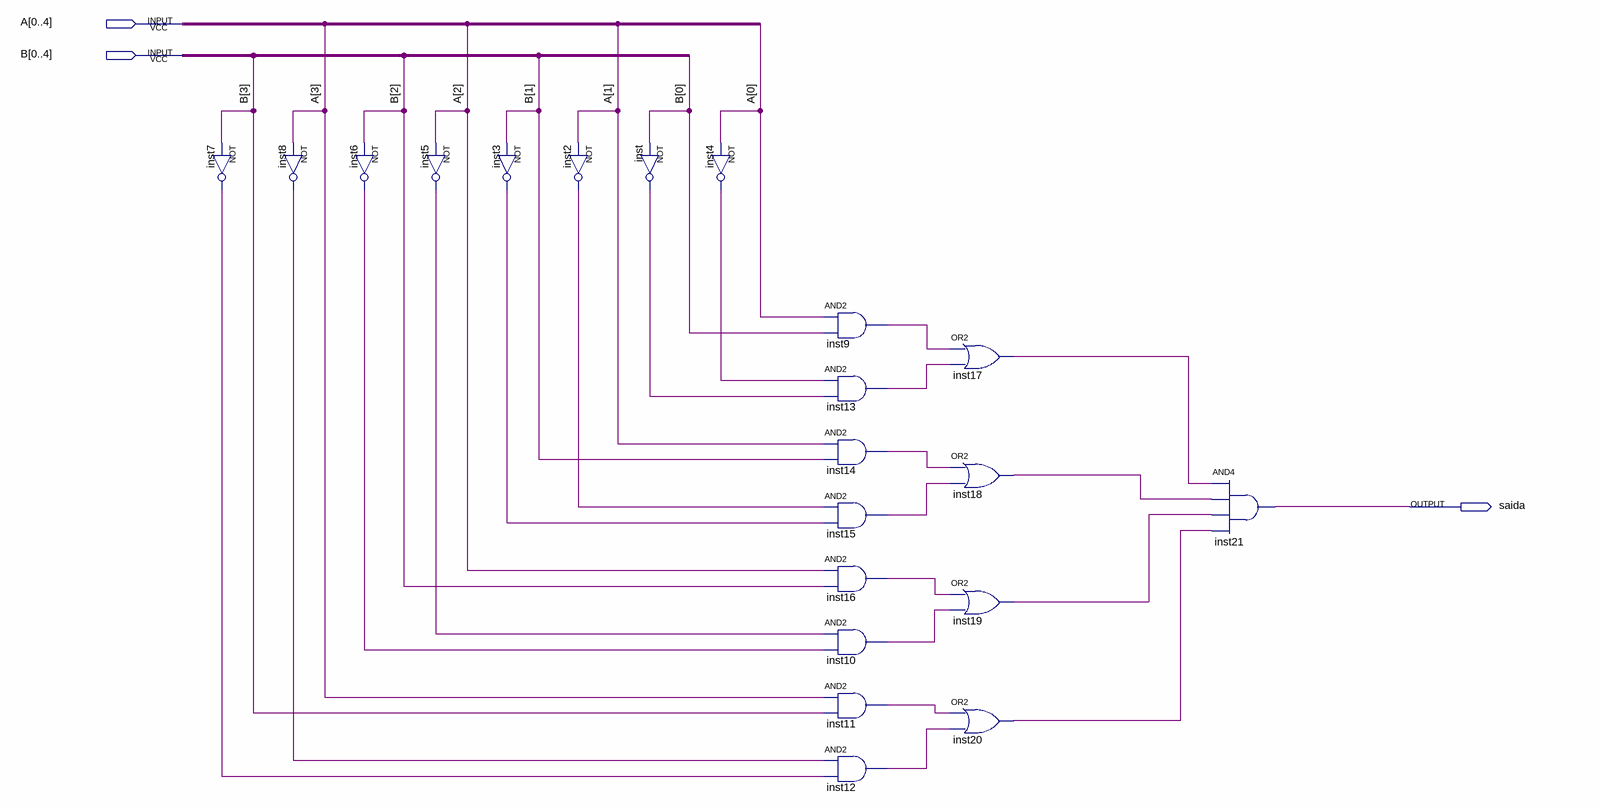
[diagram p0: schematic sheet]
// Quartus schematic AigualB.bdf as structural Verilog: 21 symbols, 3 pins
module AigualB (
  input  [0:4] A,
  input  [0:4] B,
  output saida
);

  wire inst2_out, inst3_out, inst4_out, inst5_out, inst6_out, inst7_out, inst8_out, inst9_out, inst10_out,
       inst11_out, inst12_out, inst13_out, inst14_out, inst15_out, inst16_out, inst17_out, inst18_out,
       inst19_out, inst20_out, inst_out;

  not inst7 (inst7_out, B[3]);
  not inst8 (inst8_out, A[3]);
  not inst6 (inst6_out, B[2]);
  not inst5 (inst5_out, A[2]);
  not inst3 (inst3_out, B[1]);
  not inst2 (inst2_out, A[1]);
  not inst (inst_out, B[0]);
  not inst4 (inst4_out, A[0]);
  and inst9 (inst9_out, A[0], B[0]);
  and inst13 (inst13_out, inst4_out, inst_out);
  and inst14 (inst14_out, A[1], B[1]);
  and inst15 (inst15_out, inst2_out, inst3_out);
  and inst16 (inst16_out, A[2], B[2]);
  and inst10 (inst10_out, inst5_out, inst6_out);
  and inst11 (inst11_out, A[3], B[3]);
  and inst12 (inst12_out, inst8_out, inst7_out);
  or inst17 (inst17_out, inst9_out, inst13_out);
  or inst18 (inst18_out, inst14_out, inst15_out);
  or inst19 (inst19_out, inst16_out, inst10_out);
  or inst20 (inst20_out, inst11_out, inst12_out);
  and inst21 (saida, inst17_out, inst18_out, inst19_out, inst20_out);
endmodule
